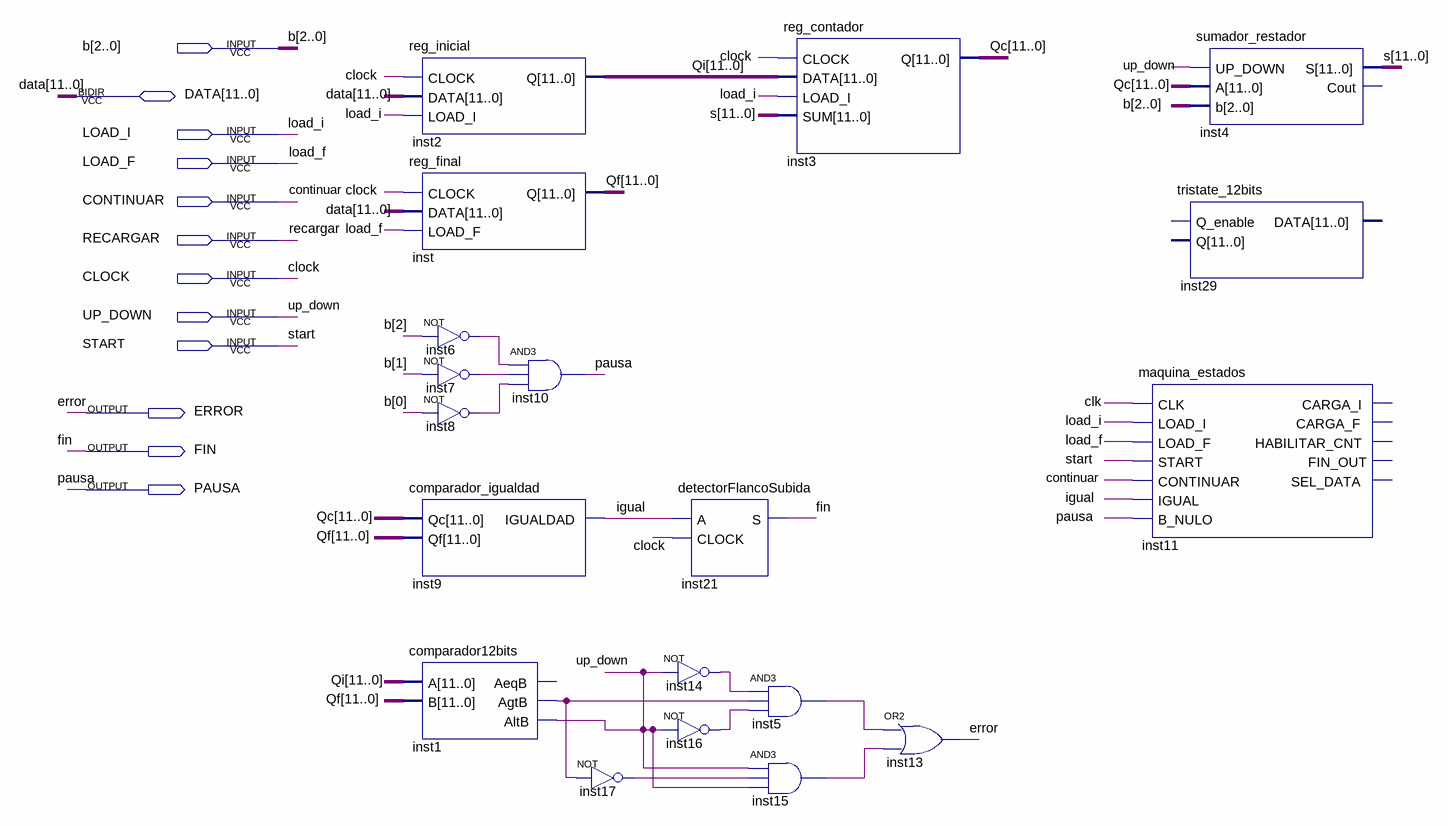
[diagram p0: schematic sheet]
// Quartus schematic TpIntegrador.bdf as structural Verilog: 19 symbols, 12 pins
module TpIntegrador (
  input  [2:0] b,
  input  LOAD_I,
  input  LOAD_F,
  input  CONTINUAR,
  input  RECARGAR,
  input  CLOCK,
  input  UP_DOWN,
  input  START,
  inout  [11:0] DATA,
  output ERROR,
  output FIN,
  output PAUSA
);

  wire clk, igual, inst1_agtb, inst5_out, inst6_out, inst7_out, inst8_out, inst14_out, inst15_out,
       inst16_out, inst17_out;
  wire [11:0] Qc, Qf, Qi, s;

  reg_inicial inst2 (.CLOCK(CLOCK), .DATA(DATA), .LOAD_I(LOAD_I), .Q(Qi));
  reg_final inst (.CLOCK(CLOCK), .DATA(DATA), .LOAD_F(LOAD_F), .Q(Qf));
  comparador_igualdad inst9 (.Qc(Qc), .Qf(Qf), .IGUALDAD(igual));
  comparador12bits inst1 (.A(Qi), .B(Qf), .AgtB(inst1_agtb), .AltB(UP_DOWN));  // open: AeqB
  not inst6 (inst6_out, b[2]);
  not inst7 (inst7_out, b[1]);
  not inst8 (inst8_out, b[0]);
  and inst10 (PAUSA, inst6_out, inst7_out, inst8_out);
  not inst17 (inst17_out, inst1_agtb);
  detectorFlancoSubida inst21 (.A(igual), .CLOCK(CLOCK), .S(FIN));
  not inst14 (inst14_out, UP_DOWN);
  not inst16 (inst16_out, UP_DOWN);
  reg_contador inst3 (.CLOCK(CLOCK), .DATA(Qi), .LOAD_I(LOAD_I), .SUM(s), .Q(Qc));
  and inst5 (inst5_out, inst14_out, inst1_agtb, inst16_out);
  and inst15 (inst15_out, UP_DOWN, inst17_out, UP_DOWN);
  or inst13 (ERROR, inst5_out, inst15_out);
  tristate_12bits inst29 ();  // open: Q_enable, Q, DATA
  maquina_estados inst11 (
    .CLK(clk), .LOAD_I(LOAD_I), .LOAD_F(LOAD_F), .START(START), .CONTINUAR(CONTINUAR), .IGUAL(igual),
    .B_NULO(PAUSA));  // open: CARGA_I, CARGA_F, HABILITAR_CNT, FIN_OUT, SEL_DATA
  sumador_restador inst4 (.UP_DOWN(UP_DOWN), .A(Qc), .b(b), .S(s));  // open: Cout
endmodule
